# EAGLE design Estl-Board (EAGLE 9.6.2)
BEARBEITET: Jakob Holz; ERSATZ_FUER: 1.5; ERSTELLER: Jakob Holz; PROJEKT: Estl-Board; VERSION: 1.0
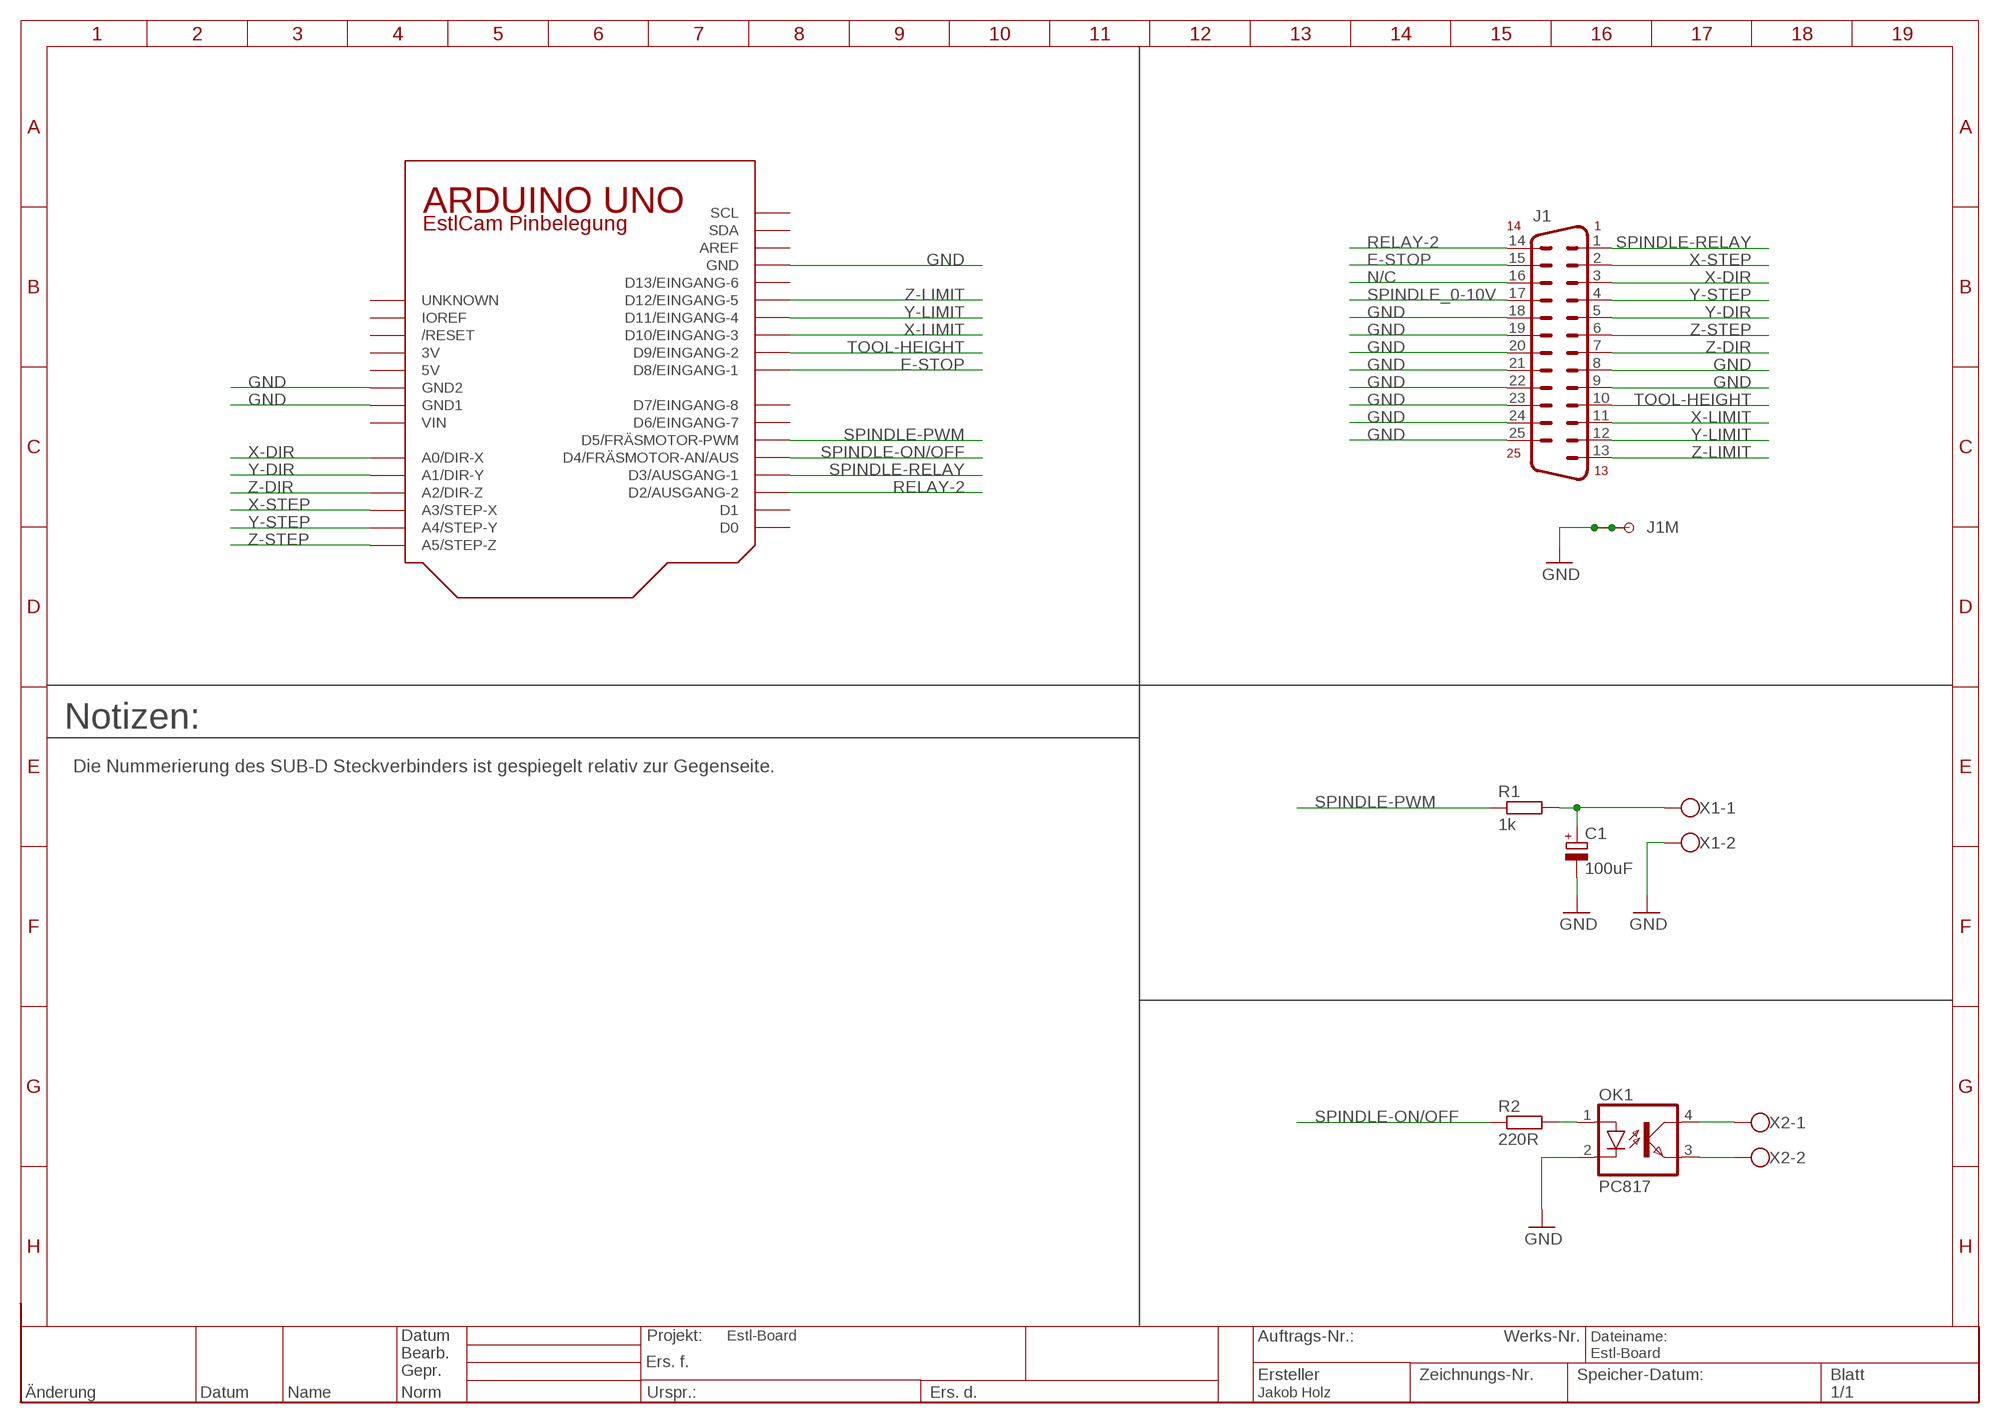
[diagram p0: schematic, sheet 1]
RAHMEN1 (RAHMEN_A4_8Z-19S): ERSTELLER: Jakob Holz; PROJEKT: Estl-Board

## Parts
C1  100uF  CPOL-EU-CAM  [E2-5-CAM]
IC1  ARDUINO  [ARDUINO_NOHOLES]
J1  JP-316B  [M25HP]
OK1  PC817  [DIP4]
R1  1k  R-EU-CAM  [207/10+]
R2  220R  R-EU-CAM  [207/10+]
X1  W237-102  [W237-102]
X2  W237-102  [W237-102]

## Nets
E-STOP: IC1.D8(D8/EINGANG-1) J1.15(E-STOP)
GND: C1.- IC1.GND IC1.GND1 IC1.GND2 J1.8(A-STEP) J1.9(A-DIR) J1.18(GND0) J1.19(GND1) J1.20(GND2) J1.21(GND3) J1.22(GND4) J1.23(GND5) J1.24(GND6) J1.25(GND7) J1.G1 J1.G2 OK1.2(C) X1.2
N$1: OK1.4(COL) X2.1
N$2: OK1.3(EMIT) X2.2
N$17: C1.+ R1.2 X1.1
N$20: OK1.1(A) R2.2
N/C: J1.16(N/C)
RELAY-2: IC1.D2(D2/AUSGANG-2) J1.14(RELAY-2)
SPINDLE-ON/OFF: IC1.D4(D4/FRÄSMOTOR-AN/AUS) R2.1
SPINDLE-PWM: IC1.D5(D5/FRÄSMOTOR-PWM) R1.1
SPINDLE-RELAY: IC1.D3(D3/AUSGANG-1) J1.1(SPINDLE-RELAY)
SPINDLE_0-10V: J1.17(SPINDLE_0-10V)
TOOL-HEIGHT: IC1.D9(D9/EINGANG-2) J1.10(TOOL-HEIGHT)
X-DIR: IC1.A0(A0/DIR-X) J1.3(X-DIR)
X-LIMIT: IC1.D10(D10/EINGANG-3) J1.11(X-LIMIT)
X-STEP: IC1.A3(A3/STEP-X) J1.2(X-STEP)
Y-DIR: IC1.A1(A1/DIR-Y) J1.5(Y-DIR)
Y-LIMIT: IC1.D11(D11/EINGANG-4) J1.12(Y-LIMIT)
Y-STEP: IC1.A4(A4/STEP-Y) J1.4(Y-STEP)
Z-DIR: IC1.A2(A2/DIR-Z) J1.7(Z-DIR)
Z-LIMIT: IC1.D12(D12/EINGANG-5) J1.13(Z-LIMIT)
Z-STEP: IC1.A5(A5/STEP-Z) J1.6(Z-STEP)
Unconnected: IC1.!KNOW1(UNKNOWN) IC1.AREF IC1.D0 IC1.D1 IC1.D6(D6/EINGANG-7) IC1.D7(D7/EINGANG-8) IC1.D13(D13/EINGANG-6) IC1.IOREF IC1.RESET(/RESET) IC1.SCL IC1.SDA

## Notes on the sheet
- Notizen:
- Die Nummerierung des SUB-D Steckverbinders ist gespiegelt relativ zur Gegenseite.

## Power pins joined to a net without a drawn wire
3V: IC1.3V
5V: IC1.5V
VIN: IC1.VIN

## Library data of the parts
C1 = Jakobs_LBR:CPOL-EU-CAM: ElKo mit breiteren Pads zum Fräsen.
IC1 = Jakobs_LBR:ARDUINO
J1 = Jakobs_LBR:JP-316B: SUB-D; OC_FARNELL: unknown; OC_NEWARK: unknown
OK1 = Jakobs_LBR:PC817: 0815 Optokoppler mit größeren Pads zum Fräsen
R1 R2 = Jakobs_LBR:R-EU-CAM: Standard Widerstand mit breiteren Pads zum Fräsen
X1 X2 = con-wago-500:W237-102: WAGO SCREW CLAMP; MPN: 237-102; OC_FARNELL: unknown; OC_NEWARK: 70K9898

## Board
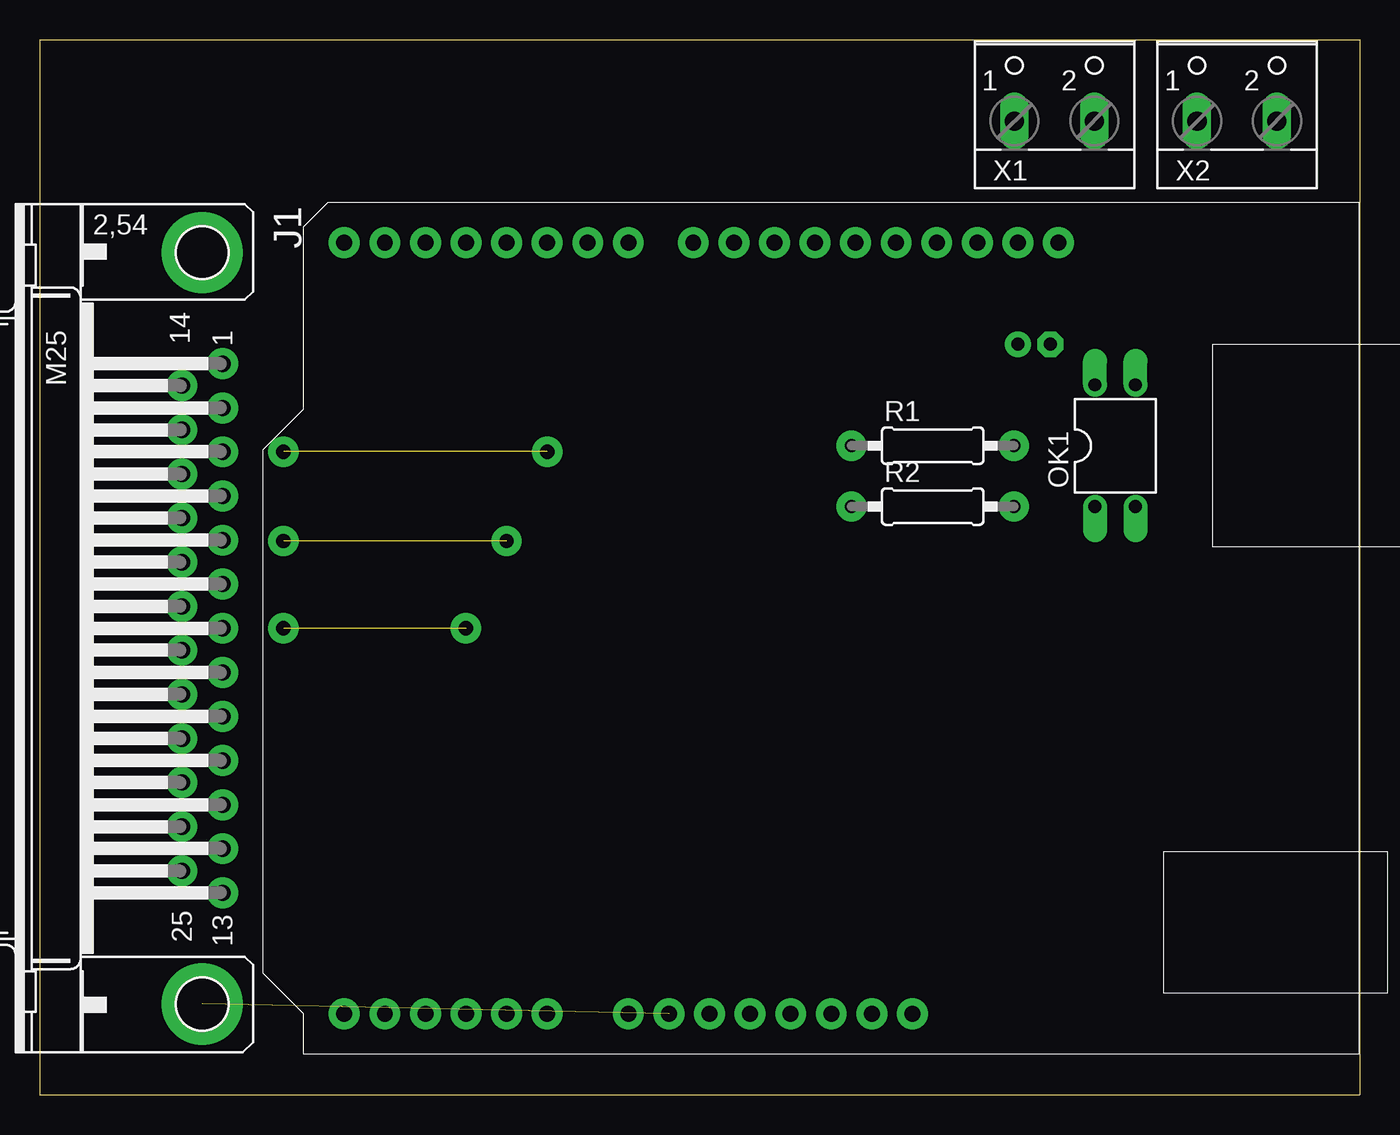
[diagram p1: board, top side]
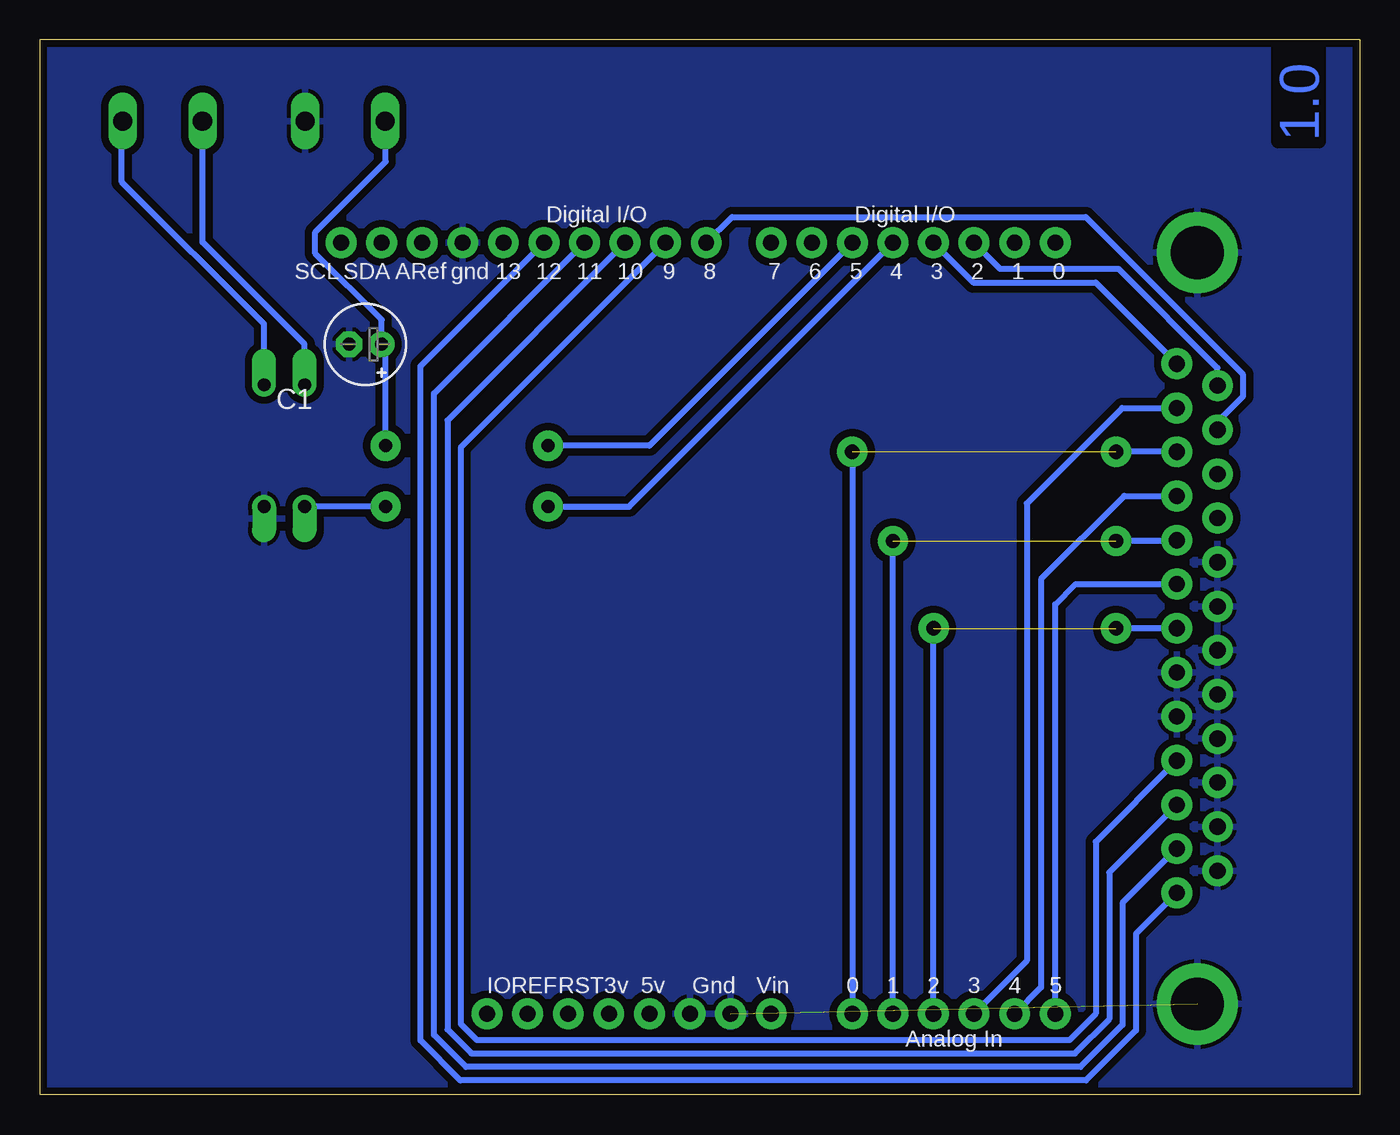
[diagram p2: board, bottom side, seen from below]

Size 82.6 x 66.04 mm. Coordinates in mm from the lower left corner, seen from the top.
Outline: 0,0 82.6,0 82.6,66.04 0,66.04 0,0
Copper layers (1*16): Top 0.035mm / dielectric 1.5mm / Bottom 0.035mm
Design rules "default *": minimum track width 15mil, minimum drill 0.35mm, track to track 18mil, track to pad 18mil, pad to pad 18mil, via to via 16mil, smd to smd 9mil, copper to edge 18mil, drill to drill 9mil, minimum pad ring 10mil, minimum via ring 8mil, stop-mask expansion 4mil, vias tented up to drill 0mil, thermal gap 10mil

### Footprints (pad centres in the part's own frame; a part is rotated, then mirrored left to right if it is on the bottom)
E2-5-CAM = drill 0.813 pad 1.6: + -1.016,0 | drill 0.813 pad 1.6 octagon: - 1.016,0
ARDUINO_NOHOLES = drill 1 pad 1.93: 3V 2.54,-24.13; 5V 5.08,-24.13; !KNOW1 -5.08,-24.13; A0 17.78,-24.13; A1 20.32,-24.13; A2 22.86,-24.13; A3 25.4,-24.13; A4 27.94,-24.13; A5 30.48,-24.13; AREF -9.144,24.13; D0 30.48,24.13; D1 27.94,24.13; D2 25.4,24.13; D3 22.86,24.13; D4 20.32,24.13; D5 17.78,24.13; D6 15.24,24.13; D7 12.7,24.13; D8 8.636,24.13; D9 6.096,24.13; D10 3.556,24.13; D11 1.016,24.13; D12 -1.524,24.13; D13 -4.064,24.13; GND -6.604,24.13; GND1 10.16,-24.13; GND2 7.62,-24.13; IOREF -2.54,-24.13; RESET 0,-24.13; SCL -14.224,24.13; SDA -11.684,24.13; VIN 12.7,-24.13
M25HP = drill 1.016 pad 1.93: 1 -16.561,1.27; 2 -13.792,1.27; 3 -11.049,1.27; 4 -8.28,1.27; 5 -5.512,1.27; 6 -2.769,1.27; 7 0,1.27; 8 2.769,1.27; 9 5.512,1.27; 10 8.28,1.27; 11 11.049,1.27; 12 13.792,1.27; 13 16.561,1.27; 14 -15.189,-1.27; 15 -12.421,-1.27; 16 -9.652,-1.27; 17 -6.909,-1.27; 18 -4.14,-1.27; 19 -1.372,-1.27; 20 1.372,-1.27; 21 4.14,-1.27; 22 6.909,-1.27; 23 9.652,-1.27; 24 12.421,-1.27; 25 15.189,-1.27 | drill 3.302 pad 5.08: G1 -23.52,0; G2 23.52,0
DIP4 = drill 0.813 pad 1.5 offset: 1 -1.27,-3.81; 2 1.27,-3.81; 3 1.27,3.81; 4 -1.27,3.81
207/10+ = drill 0.813 pad 1.9: 1 -5.08,0; 2 5.08,0
W237-102 = drill 1.194 long: 1 -2.5,-1.27; 2 2.5,-1.27

### Placement (x,y rotation side)
C1  62.23,46.99 180 bottom
IC1  49.53,29.21 0 bottom
J1  10.16,29.21 270 top
OK1  67.31,40.64 0 top
R1  55.88,40.64 0 top
R2  55.88,36.83 0 top
X1  63.5,62.23 0 top
X2  74.93,62.23 0 top

### Tracks (layer width: path | path; a pad name or v marks a point on that pad's centre or on a via)
E-STOP
  Bottom 0.381: J1.15 8.89,42.12 7.28,43.73 7.28,45.08 17.15,54.95 39.28,54.95 IC1.D8
GND  (1 unrouted)
  pour Bottom: -1.27,-3.81 -1.27,67.31 83.82,67.31 83.82,-3.81
N$1
  Bottom 0.381: OK1.4 66.04,46.99 72.43,53.38 X2.1
N$2
  Bottom 0.381: OK1.3 68.58,48.26 77.47,57.15 77.47,60.92 X2.2
N$17
  Bottom 0.381: R1.2 60.96,46.74 C1.+ 61.21,48.52 65.37,52.67 65.37,54.01 60.96,58.42 60.96,60.92 X1.1
N$20
  Bottom 0.381: R2.2 OK1.1
RELAY-2
  Bottom 0.381: J1.14 8.89,45.51 15.08,51.7 22.49,51.7 IC1.D2
SPINDLE-ON/OFF
  Bottom 0.381: R2.1 45.72,36.83 IC1.D4
SPINDLE-PWM
  Bottom 0.381: IC1.D5 44.45,40.64 R1.1
SPINDLE-RELAY
  Bottom 0.381: J1.1 16.51,50.85 24.18,50.85 IC1.D3
TOOL-HEIGHT
  Bottom 0.381: J1.10 16.51,15.85 16.51,5.08 18.16,3.43 55.24,3.43 56.26,4.45 56.26,40.51 IC1.D9
X-DIR  (via drill 0.9 pad 1.9)  (1 unrouted)
  Bottom 0.381: v31.75,40.26 IC1.A0 | J1.3 v15.24,40.26
X-LIMIT
  Bottom 0.381: J1.11 15.67,13.92 15.67,4.73 17.81,2.59 55.59,2.59 57.1,4.1 57.1,42.22 IC1.D10
X-STEP
  Bottom 0.381: IC1.A3 20.83,8.38 20.83,37.03 14.86,43 J1.2
Y-DIR  (via drill 0.9 pad 1.9)  (1 unrouted)
  Bottom 0.381: IC1.A1 v29.21,34.67 | J1.5 11.48,34.67 v15.24,34.67
Y-LIMIT
  Bottom 0.381: J1.12 14.83,12.01 14.83,4.39 17.47,1.75 55.94,1.75 57.94,3.75 57.94,43.92 IC1.D11
Y-STEP
  Bottom 0.381: IC1.A4 19.94,6.73 19.94,32.28 14.73,37.49 J1.4
Z-DIR  (via drill 0.9 pad 1.9)  (1 unrouted)
  Bottom 0.381: IC1.A2 v26.67,29.21 | J1.7 v15.24,29.21
Z-LIMIT
  Bottom 0.381: J1.13 13.99,10.08 13.99,4.04 17.12,0.91 56.29,0.91 58.78,3.4 58.78,45.62 IC1.D12
Z-STEP
  Bottom 0.381: IC1.A5 19.05,30.71 17.78,31.98 J1.6